# EAGLE design sticks-apa102-p1b (EAGLE 8.6.0)
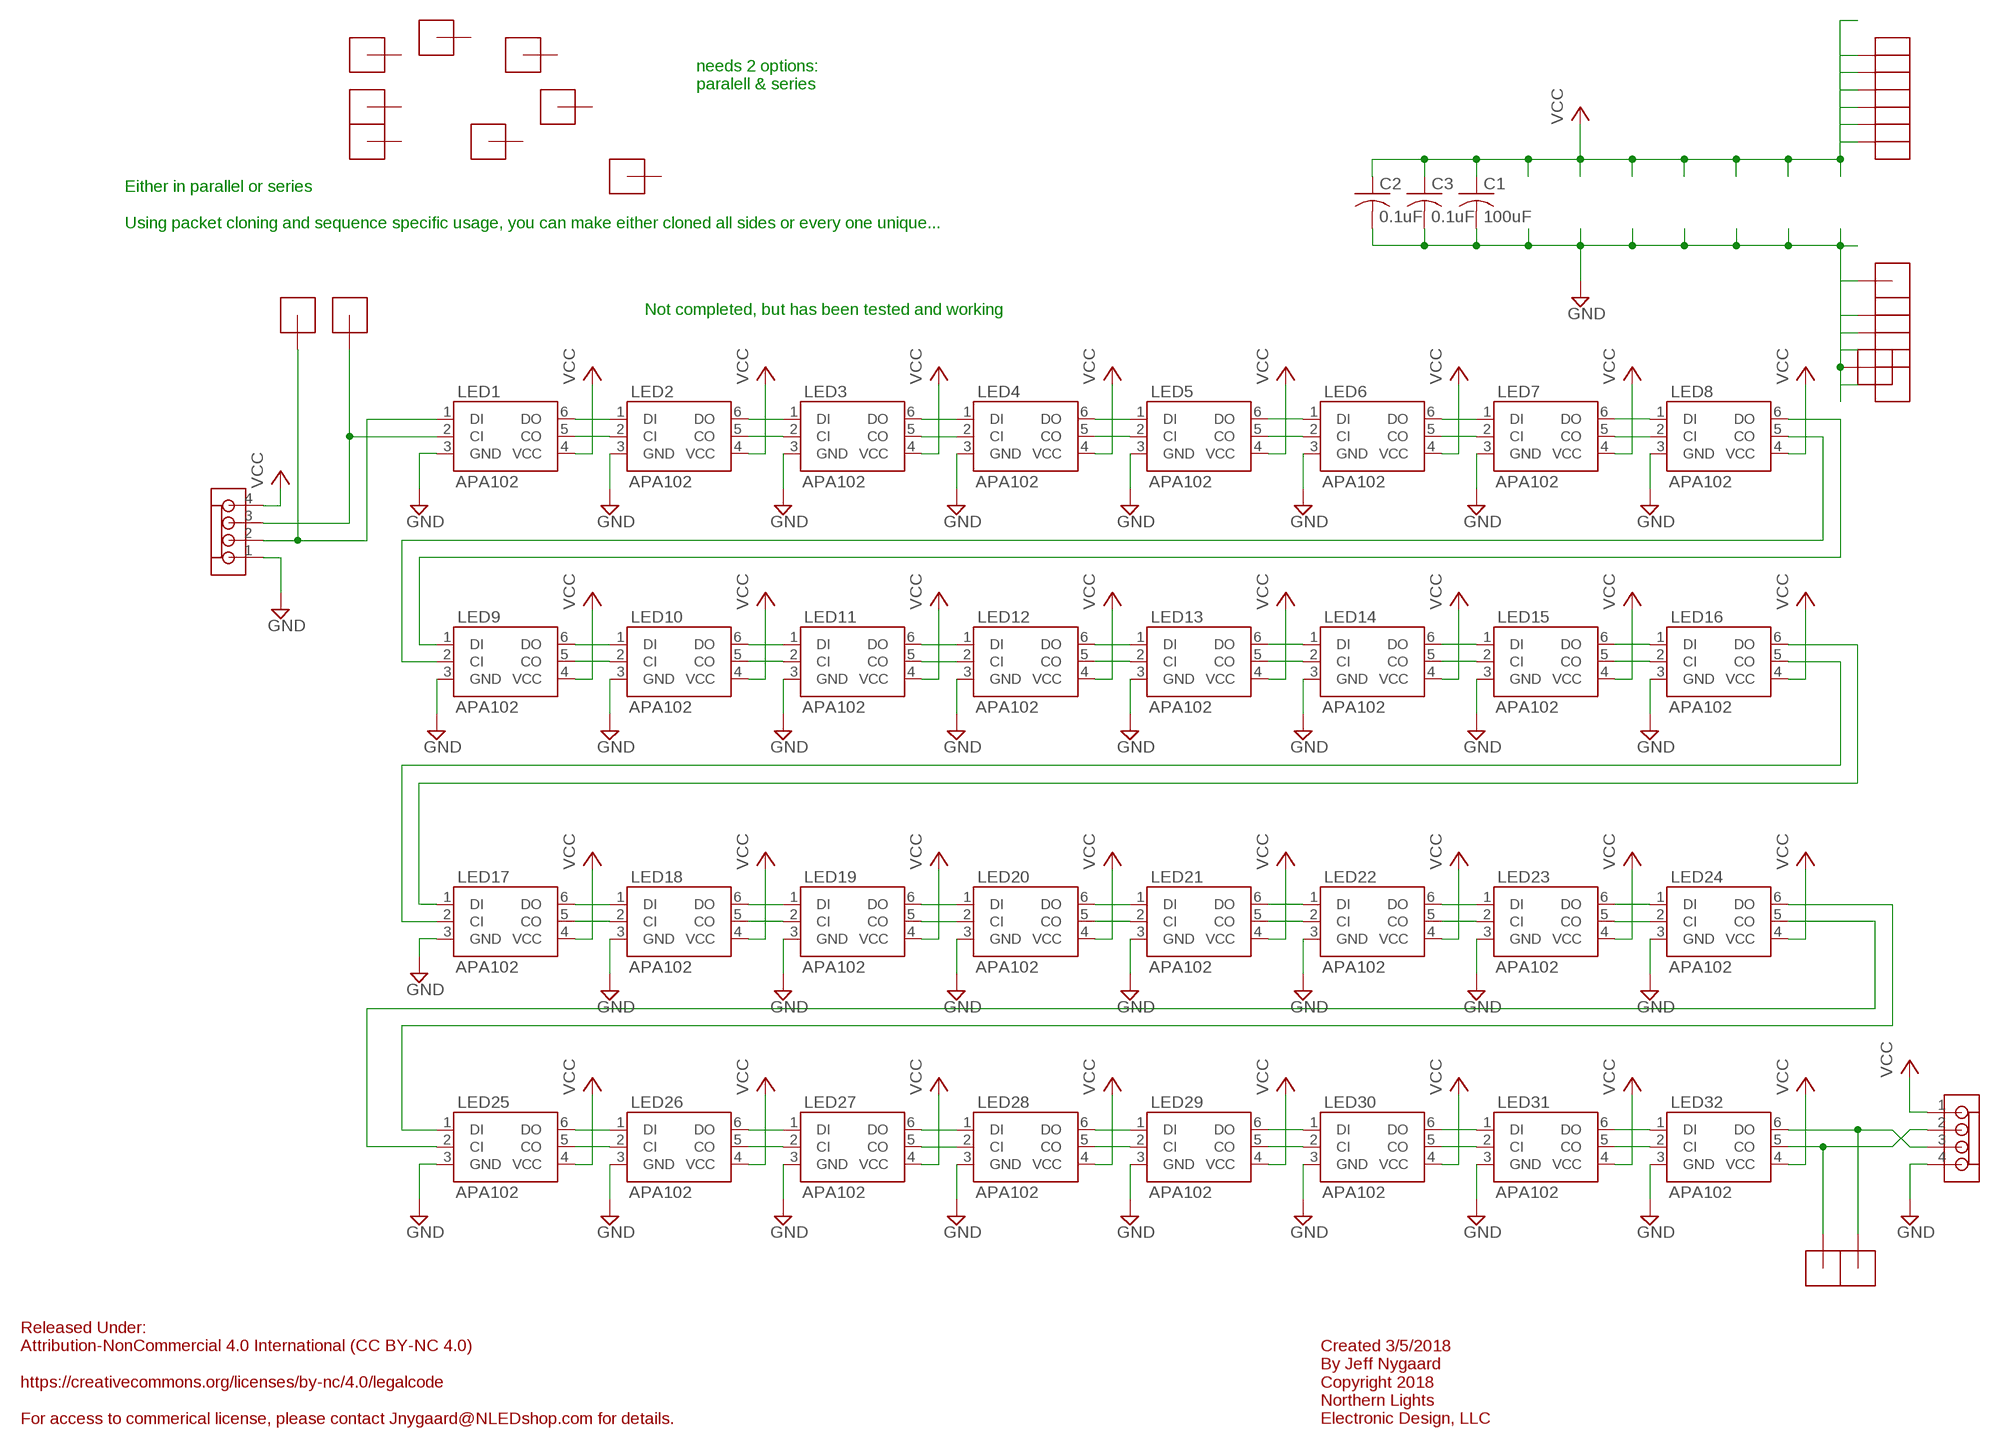
[diagram p0: schematic, sheet 1]

## Parts
C1  100uF  C-USC1206  [C1206]
C2  0.1uF  C-USC1206  [C1206]
C3  0.1uF  C-USC1206  [C1206]
CLKI  1HEADER  [J1]
CLKO  1HEADER  [J1]
DATI  1HEADER  [J1]
DATO  1HEADER  [J1]
IN  MOLEXKK4  [MOLEXKK4]
JGND1  1HEADER  [J1]
JGND2  1HEADER  [J1]
JGND3  1HEADER  [J1]
JGND4  1HEADER  [J1]
JGND5  1HEADER  [J1]
JGND6  1HEADER  [J1]
JVCC1  1HEADER  [J1]
JVCC2  1HEADER  [J1]
JVCC3  1HEADER  [J1]
JVCC4  1HEADER  [J1]
JVCC5  1HEADER  [J1]
JVCC6  1HEADER  [J1]
LED1  APA102  [APA102]
LED2  APA102  [APA102]
LED3  APA102  [APA102]
LED4  APA102  [APA102]
LED5  APA102  [APA102]
LED6  APA102  [APA102]
LED7  APA102  [APA102]
LED8  APA102  [APA102]
LED9  APA102  [APA102]
LED10  APA102  [APA102]
LED11  APA102  [APA102]
LED12  APA102  [APA102]
LED13  APA102  [APA102]
LED14  APA102  [APA102]
LED15  APA102  [APA102]
LED16  APA102  [APA102]
LED17  APA102  [APA102]
LED18  APA102  [APA102]
LED19  APA102  [APA102]
LED20  APA102  [APA102]
LED21  APA102  [APA102]
LED22  APA102  [APA102]
LED23  APA102  [APA102]
LED24  APA102  [APA102]
LED25  APA102  [APA102]
LED26  APA102  [APA102]
LED27  APA102  [APA102]
LED28  APA102  [APA102]
LED29  APA102  [APA102]
LED30  APA102  [APA102]
LED31  APA102  [APA102]
LED32  APA102  [APA102]
M1  1HEADER  [J1]
M2  1HEADER  [J1]
M3  1HEADER  [J1]
M4  1HEADER  [J1]
M5  1HEADER  [J1]
M6  1HEADER  [J1]
M7  1HEADER  [J1]
M8  1HEADER  [J1]
OUT  MOLEXKK4  [MOLEXKK4]

## Nets
GND: C1.2 C2.2 C3.2 IN.1 JGND1.2(J1) JGND2.2(J1) JGND3.2(J1) JGND4.2(J1) JGND5.2(J1) JGND6.2(J1) LED1.3(GND) LED2.3(GND) LED3.3(GND) LED4.3(GND) LED5.3(GND) LED6.3(GND) LED7.3(GND) LED8.3(GND) LED9.3(GND) LED10.3(GND) LED11.3(GND) LED12.3(GND) LED13.3(GND) LED14.3(GND) LED15.3(GND) LED16.3(GND) LED17.3(GND) LED18.3(GND) LED19.3(GND) LED20.3(GND) LED21.3(GND) LED22.3(GND) LED23.3(GND) LED24.3(GND) LED25.3(GND) LED26.3(GND) LED27.3(GND) LED28.3(GND) LED29.3(GND) LED30.3(GND) LED31.3(GND) LED32.3(GND) OUT.4
N$1: LED1.6(DO) LED2.1(DI)
N$2: LED2.6(DO) LED3.1(DI)
N$3: LED3.6(DO) LED4.1(DI)
N$4: LED3.5(CO) LED4.2(CI)
N$5: LED2.5(CO) LED3.2(CI)
N$6: LED1.5(CO) LED2.2(CI)
N$7: LED4.6(DO) LED5.1(DI)
N$8: LED4.5(CO) LED5.2(CI)
N$9: LED5.6(DO) LED6.1(DI)
N$10: LED5.5(CO) LED6.2(CI)
N$11: LED8.5(CO) LED9.2(CI)
N$12: LED8.6(DO) LED9.1(DI)
N$13: LED7.6(DO) LED8.1(DI)
N$14: LED7.5(CO) LED8.2(CI)
N$15: LED6.5(CO) LED7.2(CI)
N$16: LED6.6(DO) LED7.1(DI)
N$17: LED17.6(DO) LED18.1(DI)
N$18: LED18.6(DO) LED19.1(DI)
N$19: LED19.6(DO) LED20.1(DI)
N$20: LED19.5(CO) LED20.2(CI)
N$21: LED18.5(CO) LED19.2(CI)
N$22: LED9.6(DO) LED10.1(DI)
N$23: LED10.6(DO) LED11.1(DI)
N$24: LED11.6(DO) LED12.1(DI)
N$25: LED11.5(CO) LED12.2(CI)
N$26: LED10.5(CO) LED11.2(CI)
N$27: LED9.5(CO) LED10.2(CI)
N$28: LED12.6(DO) LED13.1(DI)
N$29: LED12.5(CO) LED13.2(CI)
N$30: LED13.6(DO) LED14.1(DI)
N$31: LED13.5(CO) LED14.2(CI)
N$32: LED14.6(DO) LED15.1(DI)
N$33: LED14.5(CO) LED15.2(CI)
N$34: LED15.6(DO) LED16.1(DI)
N$35: LED15.5(CO) LED16.2(CI)
N$36: LED17.5(CO) LED18.2(CI)
N$37: LED20.6(DO) LED21.1(DI)
N$38: LED20.5(CO) LED21.2(CI)
N$39: LED21.6(DO) LED22.1(DI)
N$40: LED21.5(CO) LED22.2(CI)
N$41: LED25.6(DO) LED26.1(DI)
N$42: LED26.6(DO) LED27.1(DI)
N$43: LED27.6(DO) LED28.1(DI)
N$44: LED27.5(CO) LED28.2(CI)
N$45: LED26.5(CO) LED27.2(CI)
N$46: LED25.5(CO) LED26.2(CI)
N$47: LED28.6(DO) LED29.1(DI)
N$48: LED28.5(CO) LED29.2(CI)
N$49: LED29.6(DO) LED30.1(DI)
N$50: LED29.5(CO) LED30.2(CI)
N$51: LED30.6(DO) LED31.1(DI)
N$52: LED30.5(CO) LED31.2(CI)
N$53: LED31.6(DO) LED32.1(DI)
N$54: LED31.5(CO) LED32.2(CI)
N$55: LED23.6(DO) LED24.1(DI)
N$56: LED23.5(CO) LED24.2(CI)
N$57: LED22.5(CO) LED23.2(CI)
N$58: LED22.6(DO) LED23.1(DI)
N$59: LED24.6(DO) LED25.1(DI)
N$60: LED24.5(CO) LED25.2(CI)
N$61: LED16.5(CO) LED17.2(CI)
N$62: DATO.2(J1) LED32.6(DO) OUT.3
N$63: CLKO.2(J1) LED32.5(CO) OUT.2
N$87: LED16.6(DO) LED17.1(DI)
N$122: DATI.2(J1) IN.2 LED1.1(DI)
N$123: CLKI.2(J1) IN.3 LED1.2(CI)
VCC: C1.1 C2.1 C3.1 IN.4 JVCC1.2(J1) JVCC2.2(J1) JVCC3.2(J1) JVCC4.2(J1) JVCC5.2(J1) JVCC6.2(J1) LED1.4(VCC) LED2.4(VCC) LED3.4(VCC) LED4.4(VCC) LED5.4(VCC) LED6.4(VCC) LED7.4(VCC) LED8.4(VCC) LED9.4(VCC) LED10.4(VCC) LED11.4(VCC) LED12.4(VCC) LED13.4(VCC) LED14.4(VCC) LED15.4(VCC) LED16.4(VCC) LED17.4(VCC) LED18.4(VCC) LED19.4(VCC) LED20.4(VCC) LED21.4(VCC) LED22.4(VCC) LED23.4(VCC) LED24.4(VCC) LED25.4(VCC) LED26.4(VCC) LED27.4(VCC) LED28.4(VCC) LED29.4(VCC) LED30.4(VCC) LED31.4(VCC) LED32.4(VCC) OUT.1
Unconnected: M1.2(J1) M2.2(J1) M3.2(J1) M4.2(J1) M5.2(J1) M6.2(J1) M7.2(J1) M8.2(J1)

## Notes on the sheet
- needs 2 options:
  paralell & series
- Either in parallel or series
  
  Using packet cloning and sequence specific usage, you can make either cloned all sides or every one unique...
- Not completed, but has been tested and working
- Released Under:
  Attribution-NonCommercial 4.0 International (CC BY-NC 4.0)
  
  https://creativecommons.org/licenses/by-nc/4.0/legalcode
  
  For access to commerical license, please contact Jnygaard@NLEDshop.com for details.
- Created 3/5/2018
  By Jeff Nygaard
  Copyright 2018
  Northern Lights
  Electronic Design, LLC

## Library data of the parts
C1-C3 = rcl:C-US: CAPACITOR, American symbol
CLKI CLKO DATI DATO JGND1-JGND6 JVCC1-JVCC6 M1-M8 = ChromationSystems-1:1HEADER
IN OUT = ChromationSystems-1:MOLEXKK4
LED1-LED32 = ChromationSystems-2:APA102

## Board
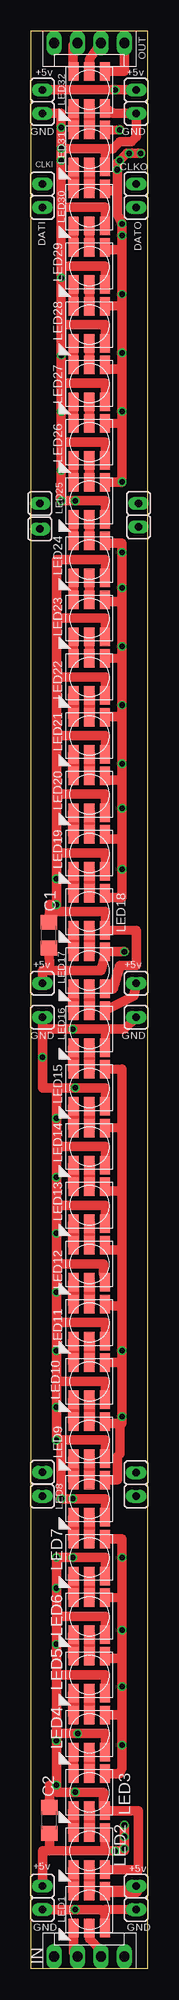
[diagram p1: board, top side]
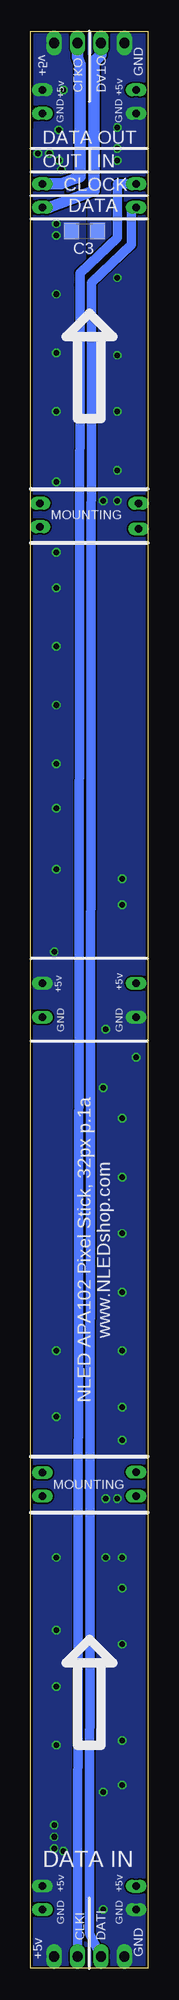
[diagram p2: board, bottom side, seen from below]

Size 12.7 x 209.55 mm. Coordinates in mm from the lower left corner, seen from the top.
Outline: 0,0 12.7,0 12.7,209.55 0,209.55 0,0
Copper layers (1*16): Top 0.035mm / dielectric 1.5mm / Bottom 0.035mm
Design rules "SeeedStudio_2layer_DRU_no_angle_20140221 *": minimum track width 6mil, minimum drill 12mil, track to track 6mil, track to pad 6mil, pad to pad 6mil, via to via 6mil, smd to smd 0mil, copper to edge 10mil, drill to drill 10mil, minimum pad ring 10mil, minimum via ring 6mil, stop-mask expansion 2mil, vias tented up to drill 100mil, thermal gap 10mil

### Footprints (pad centres in the part's own frame; a part is rotated, then mirrored left to right if it is on the bottom)
C1206 = smd 1.6 x 1.8: 1 -1.4,0; 2 1.4,0
J1 = drill 0.813 pad 1.422 long: 2 0,0
MOLEXKK4 = drill 1.1 long: 1 -3.81,0; 2 -1.27,0; 3 1.27,0; 4 3.81,0
APA102 = smd 2 x 1.1: 1 -2,1.7; 2 -2,0; 3 -2,-1.7; 4 2,-1.7; 5 2,0; 6 2,1.7

### Placement (x,y rotation side)
C1  1.97,111.76 90 top
C2  2.03,16 90 top
C3  6.86,187.96 0 bottom
CLKI  1.27,193.04 0 top
CLKO  11.43,193.04 0 top
DATI  1.27,190.5 0 top
DATO  11.43,190.5 0 top
IN  6.35,1.27 0 top
JGND1  1.27,6.35 180 top
JGND2  11.43,6.35 0 top
JGND3  1.27,200.66 0 top
JGND4  11.43,200.66 0 top
JGND5  1.27,102.87 0 top
JGND6  11.43,102.87 0 top
JVCC1  1.27,8.89 180 top
JVCC2  11.43,8.89 0 top
JVCC3  1.27,203.2 0 top
JVCC4  11.43,203.2 0 top
JVCC5  1.27,106.55 0 top
JVCC6  11.43,106.55 0 top
LED1  6.35,6.35 90 top
LED2  6.35,12.7 90 top
LED3  6.35,19.05 90 top
LED4  6.35,25.4 90 top
LED5  6.35,31.75 90 top
LED6  6.35,38.1 90 top
LED7  6.35,44.45 90 top
LED8  6.35,50.8 90 top
LED9  6.35,57.15 90 top
LED10  6.35,63.5 90 top
LED11  6.35,69.85 90 top
LED12  6.35,76.2 90 top
LED13  6.35,82.55 90 top
LED14  6.35,88.9 90 top
LED15  6.35,95.25 90 top
LED16  6.35,101.6 90 top
LED17  6.35,107.95 90 top
LED18  6.35,114.3 90 top
LED19  6.35,120.65 90 top
LED20  6.35,127 90 top
LED21  6.35,133.35 90 top
LED22  6.35,139.7 90 top
LED23  6.35,146.05 90 top
LED24  6.35,152.4 90 top
LED25  6.35,158.75 90 top
LED26  6.35,165.1 90 top
LED27  6.35,171.45 90 top
LED28  6.35,177.8 90 top
LED29  6.35,184.15 90 top
LED30  6.35,190.5 90 top
LED31  6.35,196.85 90 top
LED32  6.35,203.2 90 top
M1  1.27,53.66 0 top
M2  1.27,51.05 0 top
M3  11.43,51.05 0 top
M4  11.43,53.59 0 top
M5  1.02,158.5 0 top
M6  1.02,155.7 0 top
M7  11.68,155.96 0 top
M8  11.68,158.5 0 top
OUT  6.35,208.28 180 top

### Tracks (layer width: path | path; a pad name or v marks a point on that pad's centre or on a via)
GND  (via drill 0.6)
  Top 1.016: JGND2.2 8.16,6.38 LED1.3 8.05,5.92 7.62,6.35 v4.83,6.35 JGND1.2 | 2.79,76.2 7.87,76.2 7.87,75.18 LED12.3 | LED13.3 8.13,81.03 8.13,82.55 2.79,82.55 | 2.79,82.55 v2.79,79.5 2.79,76.2 | LED14.3 8.13,87.38 8.13,88.9 2.79,88.9 | 2.79,88.9 v2.79,85.6 2.79,82.55 | LED15.3 8.13,93.73 8.13,95.25 v4.83,95.25 2.79,95.25 | 2.79,95.25 v2.79,91.95 2.79,88.9 | LED16.3 8.13,101.6 | LED17.3 8.89,105.92 9.65,108.46 11.43,108.46 11.43,112.27 LED18.3 8.13,112.78 8.13,114.3 2.79,114.3 v2.79,115.06 | LED19.3 8.13,119.13 8.13,120.65 2.79,120.65 | 2.79,120.65 v2.79,117.86 v2.79,115.06 | LED20.3 8.13,125.48 8.13,127 2.79,127 | 2.79,127 2.79,120.65 | 2.79,95.25 1.27,95.25 v1.27,98.55 1.27,101.6 | 1.27,101.6 JGND5.2 | 8.13,101.6 v4.57,101.6 1.27,101.6 | 8.13,101.6 10.16,101.6 JGND6.2 | LED2.3 8.13,10.67 11.68,10.67 11.68,17.02 8.13,17.02 LED3.3 7.87,17.53 7.87,19.05 v4.83,19.05 2.79,19.05 v2.79,19.81 | v2.79,19.81 v2.79,24.64 | v2.79,24.64 2.79,25.4 v5.08,25.4 8.13,25.4 LED4.3 | LED6.3 8.13,36.58 8.13,38.1 2.79,38.1 | 2.79,38.1 v2.79,35.05 2.79,31.75 | 2.79,31.75 v2.79,24.64 | LED5.3 8.13,30.23 8.13,31.75 2.79,31.75 | LED7.3 8.13,42.93 8.13,44.45 v4.57,44.45 v2.79,44.45 v2.79,41.15 2.79,38.1 | LED8.3 8.13,49.28 8.13,50.8 v4.57,50.8 v3.3,50.8 3.3,57.15 | LED9.3 8.13,55.63 8.13,57.15 3.3,57.15 | 3.3,57.15 v2.79,57.15 v2.79,60.71 2.79,63.5 | LED10.3 8.13,61.98 8.13,63.5 2.79,63.5 | 2.79,76.2 v2.79,73.15 2.79,69.85 | 2.79,69.85 v2.79,66.8 2.79,63.5 | LED11.3 8.13,68.33 8.13,69.85 2.79,69.85 | LED21.3 8.13,131.57 8.13,133.35 2.79,133.35 | 2.79,127 2.79,133.35 | 2.79,133.35 2.79,139.7 | 2.79,139.7 2.79,146.05 | 2.79,146.05 2.79,152.4 8.13,152.4 8.13,150.62 LED24.3
  Top 1.016: LED22.3 8.13,138.18 8.13,139.7 2.79,139.7 | LED23.3 8.13,144.53 8.13,146.05 2.79,146.05 | LED25.3 8.13,157.23 8.13,158.75 v4.83,158.75 v3.3,158.75 v3.3,162.05 3.3,165.1 | LED26.3 8.13,163.58 8.13,165.1 3.3,165.1 | LED27.3 8.13,169.93 8.13,171.45 3.3,171.45 | LED31.3 8.13,195.07 8.13,196.85 | v3.3,196.85 v3.3,195.58 3.3,190.5 | 3.3,190.5 3.3,184.15 | 3.3,184.15 v3.3,182.88 3.3,177.8 | 3.3,177.8 v3.3,174.5 3.3,171.45 | 3.3,171.45 v3.3,168.4 3.3,165.1 | LED29.3 8.13,182.37 8.13,184.15 3.3,184.15 | v3.3,196.85 8.13,196.85 | LED28.3 8.13,176.28 8.13,177.8 3.3,177.8 | LED30.3 8.13,188.98 8.13,190.5 3.3,190.5 | LED32.3 8.89,200.66 JGND4.2 11.43,198.12 10.92,197.61 9.65,197.61 8.89,196.85 8.13,196.85 | v3.3,196.85 v3.3,199.14 3.3,200.66 JGND3.2 | C1.2 2.03,115.06 v2.79,115.06 | C2.2 2.03,19.81 v2.79,19.81
  pour Bottom (no thermals): 0,209.55 0,0 6.35,0 6.35,209.55
N$1
  Top 1.27: LED2.1 LED1.6
N$2
  Top 1.27: LED2.6 LED3.1
N$3
  Top 1.016: LED4.1 LED3.6
N$4
  Top 1.27: LED4.2 LED3.5
N$5
  Top 1.27: LED2.5 LED3.2
N$6
  Top 1.27: LED1.5 LED2.2
N$7
  Top 1.27: LED5.1 LED4.6
N$8
  Top 1.27: LED5.2 LED4.5
N$9
  Top 1.27: LED6.1 LED5.6
N$10
  Top 1.27: LED5.5 LED6.2
N$11
  Top 1.27: LED9.2 LED8.5
N$12
  Top 1.27: LED9.1 LED8.6
N$13
  Top 1.27: LED8.1 LED7.6
N$14
  Top 1.27: LED8.2 LED7.5
N$15
  Top 1.27: LED6.5 LED7.2
N$16
  Top 1.27: LED7.1 LED6.6
N$17
  Top 1.27: LED18.1 LED17.6
N$18
  Top 1.27: LED19.1 LED18.6
N$19
  Top 1.27: LED20.1 LED19.6
N$20
  Top 1.27: LED20.2 LED19.5
N$21
  Top 1.27: LED18.5 LED19.2
N$22
  Top 1.27: LED9.6 LED10.1
N$23
  Top 1.27: LED11.1 LED10.6
N$24
  Top 1.27: LED12.1 LED11.6
N$25
  Top 1.27: LED12.2 LED11.5
N$26
  Top 1.27: LED11.2 LED10.5
N$27
  Top 1.27: LED9.5 LED10.2
N$28
  Top 1.27: LED13.1 LED12.6
N$29
  Top 1.27: LED13.2 LED12.5
N$30
  Top 1.27: LED14.1 LED13.6
N$31
  Top 1.27: LED14.2 LED13.5
N$32
  Top 1.27: LED14.6 LED15.1
N$33
  Top 1.27: LED15.2 LED14.5
N$34
  Top 1.27: LED16.1 LED15.6
N$35
  Top 1.27: LED16.2 LED15.5
N$36
  Top 1.27: LED18.2 LED17.5
N$37
  Top 1.27: LED21.1 LED20.6
N$38
  Top 1.27: LED21.2 LED20.5
N$39
  Top 1.27: LED22.1 LED21.6
N$40
  Top 1.27: LED22.2 LED21.5
N$41
  Top 1.016: LED25.6 LED26.1
N$42
  Top 1.016: LED26.6 LED27.1
N$43
  Top 1.016: LED28.1 LED27.6
N$44
  Top 1.016: LED27.5 LED28.2
N$45
  Top 1.016: LED26.5 LED27.2
N$46
  Top 1.016: LED26.2 LED25.5
N$47
  Top 1.016: LED29.1 LED28.6
N$48
  Top 1.016: LED29.2 LED28.5
N$49
  Top 1.016: LED29.6 LED30.1
N$50
  Top 1.016: LED30.2 LED29.5
N$51
  Top 1.27: LED31.1 LED30.6
N$52
  Top 1.27: LED30.5 LED31.2
N$53
  Top 1.27: LED32.1 LED31.6
N$54
  Top 1.27: LED32.2 LED31.5
N$55
  Top 1.016: LED24.1 LED23.6
N$56
  Top 1.016: LED24.2 LED23.5
N$57
  Top 1.016: LED23.2 LED22.5
N$58
  Top 1.016: LED23.1 LED22.6
N$59
  Top 1.016: LED25.1 LED24.6
N$60
  Top 1.016: LED25.2 LED24.5
N$61
  Top 1.27: LED17.2 LED16.5
N$62
  Top 1.016: LED32.6 4.57,205.74 4.57,208.03 OUT.3
  Bottom 1.27: OUT.3 5.08,207.01 5.84,206.25 5.84,192.28 10.67,190.5 DATO.2
N$63
  Top 1.016: LED32.5 6.35,206.5 OUT.2
  Bottom 1.27: OUT.2 7.62,206.76 7.37,205.99 7.37,193.8 9.4,193.04 CLKO.2
N$87
  Top 1.27: LED17.1 LED16.6
N$122
  Top 1.016: LED1.1 4.65,1.7 IN.2
  Bottom 1.016: DATI.2 1.78,190.5 1.78,186.44 6.1,182.37 6.1,180.85 6.35,3.81 IN.2
N$123
  Top 1.016: LED1.2 6.35,3.17 7.62,1.91 IN.3
  Bottom 1.016: CLKI.2 3.3,193.04 3.3,187.2 7.37,183.39 7.37,182.12 7.62,3.81 IN.3
VCC  (via drill 0.6)
  Top 0.406: v9.91,59.69 9.65,58.42
  Top 1.016: 8.26,8.14 LED1.4 | JVCC1.2 1.27,12.7 2.03,12.7 | 2.03,12.7 8.26,12.7 | 8.26,12.7 v9.14,12.7 10.16,12.7 v10.16,15.49 | LED2.4 8.05,12.9 8.26,12.7 | LED3.4 9.62,21.05 9.91,21.59 v9.91,24.13 9.91,27.18 | LED4.4 8.08,27.43 9.65,27.43 9.91,27.18 | LED5.4 8.16,33.75 8.13,33.53 9.91,33.53 | 9.91,33.53 v9.91,36.58 9.91,40.13 | 9.91,33.53 v9.91,30.48 9.91,27.18 | LED6.4 9.91,40.13 | LED7.4 9.91,46.48 v9.91,44.45 9.91,40.13 | 8.13,58.93 LED9.4 8.13,58.67 8.13,58.93 | 8.13,71.63 LED11.4 8.89,71.63 9.91,71.63 | LED10.4 8.13,65.53 9.91,65.53 | 9.91,65.53 9.91,71.63 | LED12.4 8.38,77.72 9.91,77.72 | 9.91,77.72 9.91,71.63 | LED13.4 8.13,84.07 9.91,84.07 | 9.91,84.07 9.91,77.72 | LED14.4 9.91,90.93 | 9.91,90.93 9.91,84.07 | LED15.4 9.91,97.28 9.91,90.93 | LED17.4 8.13,109.73 | LED18.4 8.13,115.82 9.91,115.82 v9.91,118.87 9.91,122.17 | LED19.4 8.13,122.17 9.91,122.17 | LED20.4 8.13,128.52 9.91,128.52 | 9.91,128.52 v9.91,125.48 9.91,122.17 | 9.91,65.53 v9.91,59.69 9.91,58.93 9.65,58.93 | LED8.4 8.13,52.83 9.4,52.83 9.4,55.37 9.65,55.63 9.65,58.42 9.65,58.93 | 8.13,58.93 9.65,58.93 | 8.13,103.38 8.13,103.12 LED16.4 11.18,105.16 JVCC6.2 | 8.13,109.73 8.13,109.98 v10.16,109.98 | JVCC5.2 1.27,107.95 2.03,107.95 | 2.03,107.95 7.62,107.95 8.13,109.73 | LED21.4 8.13,135.38 9.91,135.38 | 9.91,135.38 9.91,128.52 | LED22.4 9.91,141.73 | 9.91,141.73 9.91,135.38 | LED23.4 8.13,147.83 9.91,147.83 | 9.91,147.83 9.91,141.73 | LED24.4 8.13,154.18 9.91,154.18 9.91,147.83 | LED27.4 8.13,172.97 9.91,172.97 | 9.91,172.97 9.91,167.13 | 9.91,167.13 v9.91,160.78 LED25.4 | LED26.4 9.91,167.13 | LED28.4 9.91,179.83 | 9.91,179.83 9.91,172.97 | LED29.4 8.13,185.93 9.91,185.93
  Top 1.016: 9.91,185.93 9.91,179.83 | 9.91,185.93 v9.91,188.72 9.4,189.74 9.4,192.28 | JVCC3.2 v9.14,203.2 JVCC4.2 | LED31.4 v9.65,198.88 | LED32.4 10.16,205.23 OUT.1 | 9.4,192.28 9.4,195.33 v9.65,195.58 10.41,196.34 v11.94,196.34 | LED30.4 8.13,192.28 9.4,192.28 | C1.1 2.03,107.95 | C2.1 2.03,12.7
  Top 1.27: LED1.4 11.43,8.35 JVCC2.2
  other vias: 9.91,66.8 9.91,136.65 9.91,130.3 9.91,143 9.91,149.35 9.91,153.16 9.91,168.4 9.91,174.75 9.91,181.1 9.91,187.45 10.16,14.22 10.16,12.95 10.67,196.34 9.4,194.56
  pour Bottom (rank 2, no thermals): 6.35,209.55 6.35,0 10.67,-0.25 12.7,-0.25 12.19,209.55

### Text on the board
tNames: +5v | +5v | GND | GND | CLKI | CLKO | DATI | DATO | +5v | +5v | GND | GND | +5v | +5v | GND | GND
bNames: GND | +5v | +5v | +5v | DATO | CLKO | GND | GND | DATA OUT | OUT IN | CLOCK | DATA | MOUNTING | +5v | +5v | GND | GND | NLED APA102 Pixel Stick, 32px p.1a / www.NLEDshop.com | MOUNTING | DATA IN | +5v | +5v | GND | GND | DATI | CLKI | GND | +5v